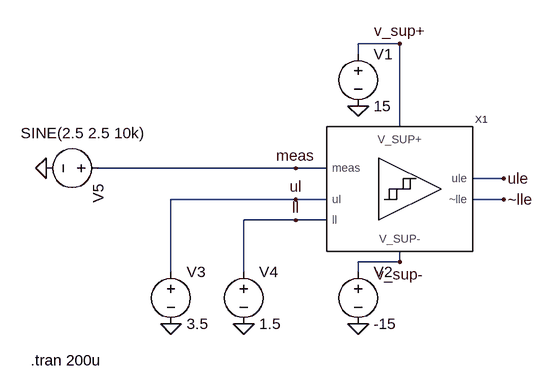
[diagram p0: schematic sim_window-comparator.asc]
sim_window-comparator.asc, the LTspice schematic file:
Version 4
SHEET 1 880 680
WIRE 208 -48 144 -48
WIRE 144 -32 144 -48
WIRE 208 80 208 -48
WIRE 48 144 -256 144
WIRE 96 144 48 144
WIRE 368 160 320 160
WIRE 48 192 -144 192
WIRE 96 192 48 192
WIRE 368 192 320 192
WIRE 48 224 -32 224
WIRE 96 224 48 224
WIRE 208 288 208 272
WIRE 208 288 144 288
WIRE -144 304 -144 192
WIRE -32 304 -32 224
WIRE 144 304 144 288
FLAG 144 48 0
FLAG 144 384 0
FLAG -32 384 0
FLAG -144 384 0
FLAG -336 144 0
FLAG 368 160 ule
FLAG 368 192 ~lle
FLAG 48 144 meas
FLAG 48 192 ul
FLAG 48 224 ll
FLAG 208 -48 v_sup+
FLAG 208 288 v_sup-
SYMBOL window-comparator 208 176 R0
SYMATTR InstName X1
SYMBOL voltage 144 -48 R0
WINDOW 123 0 0 Left 0
WINDOW 39 0 0 Left 0
SYMATTR InstName V1
SYMATTR Value 15
SYMBOL voltage 144 288 R0
WINDOW 123 0 0 Left 0
WINDOW 39 0 0 Left 0
SYMATTR InstName V2
SYMATTR Value -15
SYMBOL voltage -144 288 R0
WINDOW 123 0 0 Left 0
WINDOW 39 0 0 Left 0
SYMATTR InstName V3
SYMATTR Value 3.5
SYMBOL voltage -32 288 R0
WINDOW 123 0 0 Left 0
WINDOW 39 0 0 Left 0
SYMATTR InstName V4
SYMATTR Value 1.5
SYMBOL voltage -240 144 R90
WINDOW 3 -54 -57 VRight 2
WINDOW 123 0 0 Left 0
WINDOW 39 0 0 Left 0
SYMATTR Value SINE(2.5 2.5 10k)
SYMATTR InstName V5
TEXT -360 440 Left 2 !.tran 200u

The netlist it stands for:
* sim_window-comparator.asc
XX1 v_sup+ v_sup- ul ll meas ule ~lle window-comparator  ; pins V_SUP+ V_SUP- ul ll meas ule ~lle
V1 v_sup+ 0 15
V2 v_sup- 0 -15
V3 ul 0 3.5
V4 ll 0 1.5
V5 meas 0 SINE(2.5 2.5 10k)
.tran 200u
.backanno
.end